# Altium project OpenBLC.PrjPcb
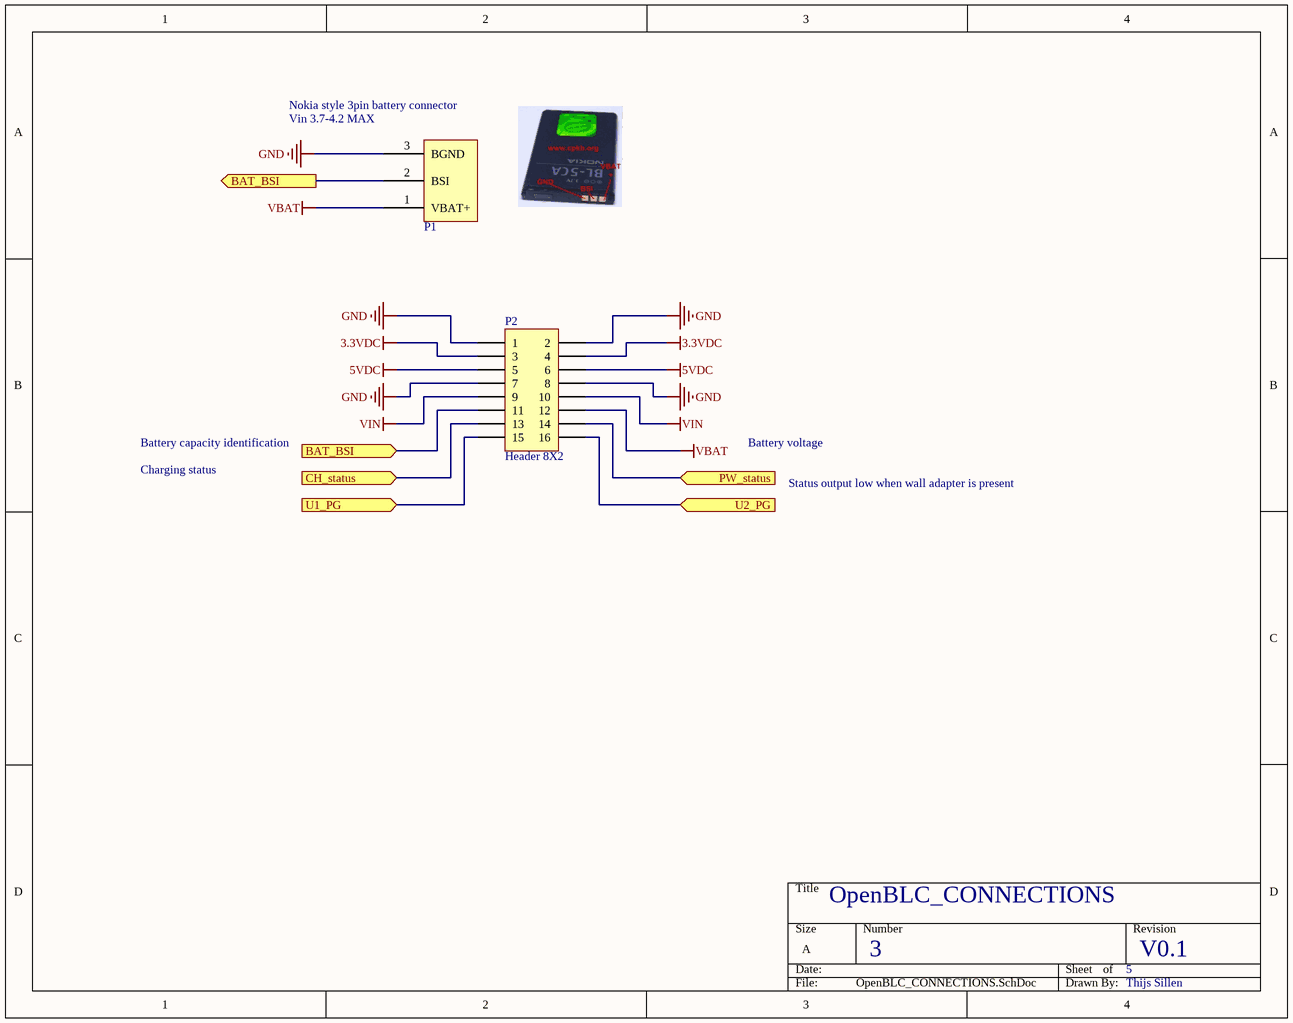
[diagram p0: OpenBLC_CONNECTIONS.SchDoc]
5 sheets, 40 parts. Net scope: flat (ports and power ports of the same name join across sheets).
Board file: OpenBLC.PcbDoc
Sheets:
  OpenBLC_CONNECTIONS.SchDoc
  OpenBLC_MCP73831.SchDoc
  OpenBLC_LTC4412.SchDoc
  OpenBLC_TPS61230.SchDoc
  OpenBLC_TPS62152.SchDoc

## Sheet OpenBLC_CONNECTIONS.SchDoc
size A

### Parts
P1  Nokia 3pin pogo connector  [Nokia_3P_batt_conn]  (value not drawn)
P2  Header 8X2  [HDR2X8]

### Ports
BAT_BSI (in), BAT_BSI (out), CH_status (in), PW_status (in), U1_PG (in), U2_PG (in)

### Nets
3.3VDC: P2.3 P2.4
5VDC: P2.5 P2.6
GND: P1.3(BGND) P2.1 P2.2 P2.7 P2.8
VBAT: P1.1(VBAT+) P2.12
VIN: P2.9 P2.10
NetP1_2: P1.2(BSI) P2.11 ; port BAT_BSI
NetP2_13: P2.13 ; port CH_status
NetP2_14: P2.14 ; port PW_status
NetP2_15: P2.15 ; port U1_PG
NetP2_16: P2.16 ; port U2_PG

### Notes on the sheet
- (near P1) Nokia style 3pin battery connector
- (near P1) Vin 3.7-4.2 MAX
- Battery capacity identification
- Charging status
- Battery voltage
- Status output low when wall adapter is present
- OpenBLC_CONNECTIONS
- 3
- 5
- V0.1
- Thijs Sillen

### Library data of the parts
P1 = Nokia_3PIN_BATT_CONTACT
P2 = Header 8X2: Header, 8-Pin, Dual row; LatestRevisionDate: 17-Jul-2002; LatestRevisionNote: Re-released for DXP Platform.; Publisher: Altium Limited

## Sheet OpenBLC_MCP73831.SchDoc
size A
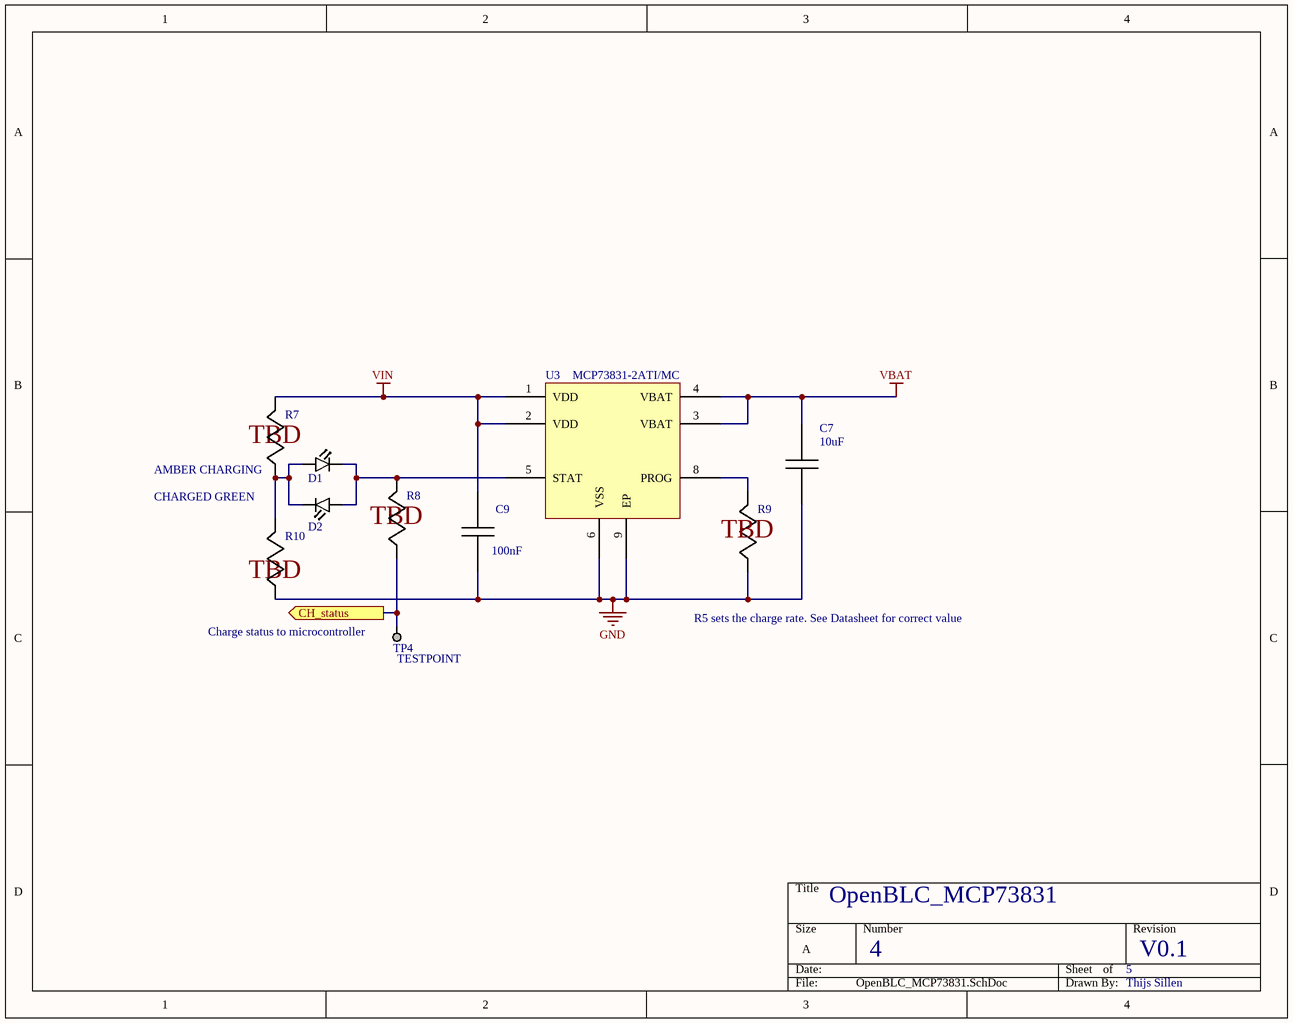
[diagram p1: OpenBLC_MCP73831.SchDoc]

### Parts
C7  Capacitance: 10uF  [0805_CAP]  (hidden comment: GRM21BR61A106KE19L)
C9  =Value: 100nF  [0805_CAP]  (hidden comment: 0805_CAP)
D1  0603LED_YE  [0603 _DIODE_YE]  (value not drawn)
D2  0603LED_GR  [0603 _DIODE_GR]  (value not drawn)
R7  0805_RES  [0805_RES]  (value not drawn)
R8  0805_RES  [0805_RES]  (value not drawn)
R9  0805_RES  [0805_RES]  (value not drawn)
R10  0805_RES  [0805_RES]  (value not drawn)
TP4  TESTPOINT  [Via_TP]
U3  MCP73831-2ATI/MC  [PQFN50P300X200X5_HS-9N]

### Ports
CH_status (out)

### Nets
GND: C7.2 C9.2 R9.2 R10.2 U3.6(VSS) U3.9(EP)
VBAT: C7.1 U3.3(VBAT) U3.4(VBAT)
VIN: C9.1 R7.1 U3.1(VDD) U3.2(VDD)
NetD1_1: D1.1 D2.2 R8.1 U3.5(STAT)
NetD1_2: D1.2 D2.1 R7.2 R10.1
NetP2_13: R8.2 TP4.1 ; port CH_status
NetR9_1: R9.1 U3.8(PROG)

### Notes on the sheet
- (near R7) AMBER CHARGING
- CHARGED GREEN
- (near R7) TBD
- (near R8) TBD
- (near R9) TBD
- (near TP4) Charge status to microcontroller
- (near R10) TBD
- R5 sets the charge rate. See Datasheet for correct value
- OpenBLC_MCP73831
- 4
- 5
- V0.1
- Thijs Sillen

### Library data of the parts
C7 = GRM21BR61A106KE19L: MURATA - GRM21BR61A106KE19L - CAPACITOR, CERA, 10UF, 10%, 10V, 10%, SMD; Product Range: MURATA - GRM Series; Dielectric Characteristic: X5; Voltage Rating: 10; Ceramic Capacitor Case: 0805 ^2012 Metric]; Supplier 1: Farnell; Supplier Part Number 1: 2396552; Manufacturer: MURATA; RoHS: YES; Stock 1: 20106; Pricing 1: 1=0.042, 250=0.039, 500=0.034, 1000=0.031, 5000=0.022 (EUR); Capacitance Tolerance: ± 10%; MSL: -; ComponentLink1URL: http://www.farnell.com/datasheets/608985.pdf; ComponentLink1Description: http://www.farnell.com/datasheets/608985.pdf; Manufacturer Part Number: GRM21BR61A106KE19L
TP4 = TESTPOINT: TESTPOINT SCOPE GRABBER; Manufacturer Part Number: 5010; Manufacturer: Keystone Electronics; Reel: TH; Supplier 1: Digi-Key; Supplier Part Number 1: 5010K-ND
U3 = MCP73831-2ATI/MC: Batterijbeheer Li-Ion/Li-Poly Charg Mgnt 4.2V Vreg out; Manufacturer: Microchip Technology; Uitgangsstroom: 15 mA to 500 mA; Verpakking / doos: DFN; Verpakken: Tube; Montagetype: SMD/SMT; Batterijtype: Li-Ion, Li-Poly; Fabrikant: Microchip; Maximale bedrijfstemperatuur: + 85 C; Minimale bedrijfstemperatuur: - 40 C; Productcategorie: Battery Management; Standaard pakket hoeveelheid: 150; Supplier 1: Mouser; Supplier Part Number 1: 579-MCP73831-2ATI/MC; RoHS: RoHS Compliant; Category: Batterijbeheer; Stock 1: 0; Pricing 1: 1=0.512, 10=0.472, 25=0.392, 100=0.360 (EUR); Uitgangspanning: 4.2 V; Merk: Microchip Technology; Producttype: Charge Management; RoHS - Mouser: Y; Minimum Order Quantity: 1; Reeling: False; ComponentLink1URL: http://www.mouser.com/ds/2/268/21984e-53484.pdf; ComponentLink1Description: http://www.mouser.com/ds/2/268/21984e-53484.pdf; Manufacturer Part Number: MCP73831-2ATI/MC

## Sheet OpenBLC_LTC4412.SchDoc
size A
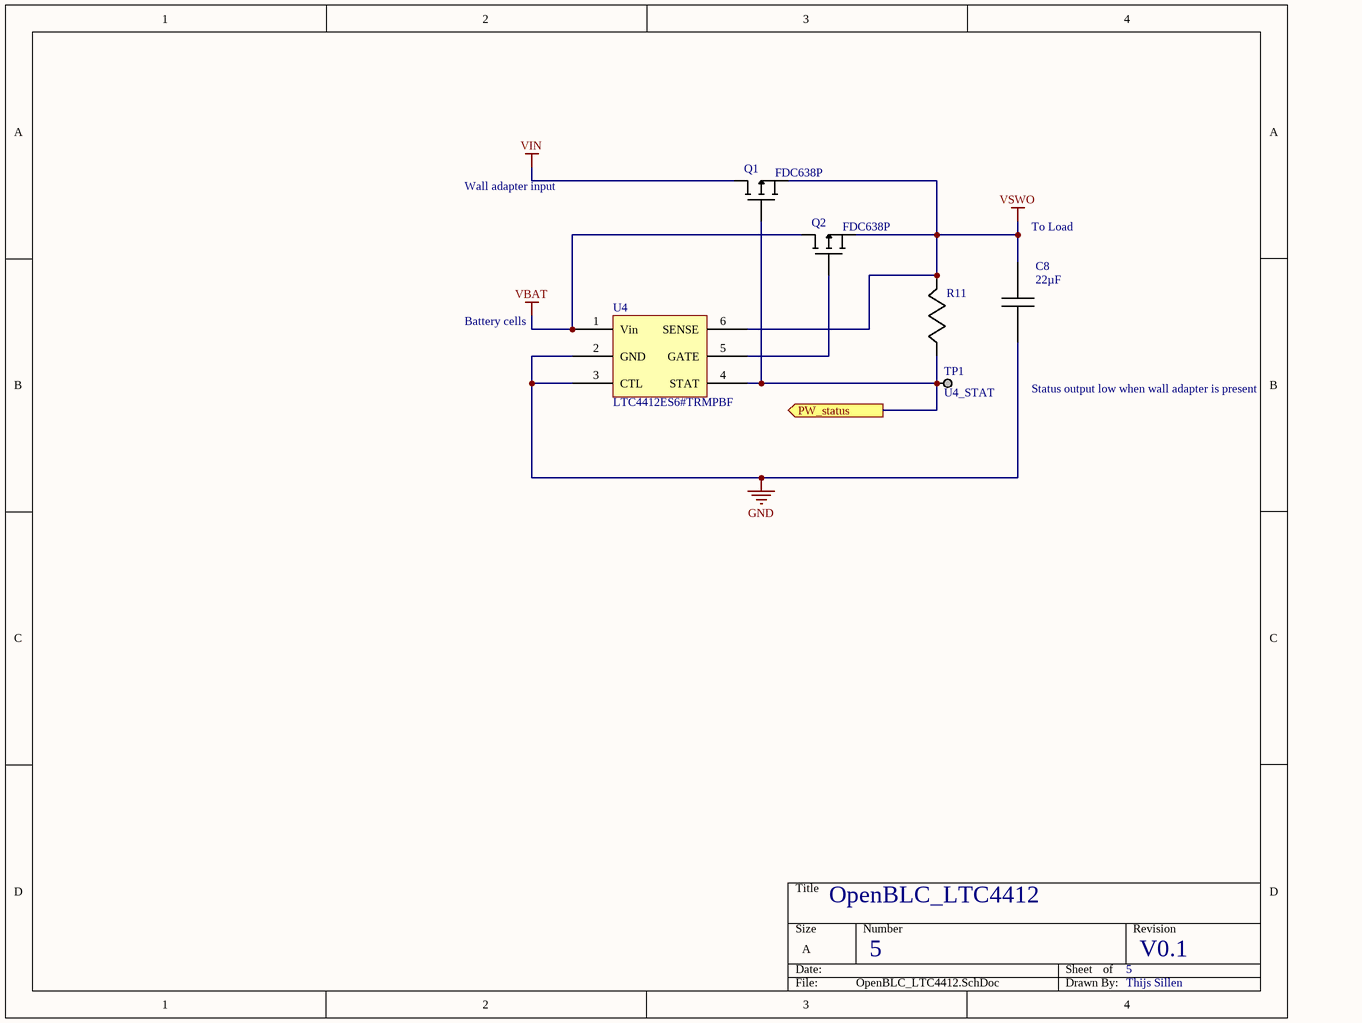
[diagram p2: OpenBLC_LTC4412.SchDoc]

### Parts
C8  Capacitance: 22µF  [0805_CAP]  (hidden comment: C2012X5R0J226M125AC)
Q1  FDC638P  [FDC638P]
Q2  FDC638P  [FDC638P]
R11  0805_RES  [0805_RES]  (value not drawn)
TP1  U4_STAT  [Via_TP]
U4  LTC4412ES6#TRMPBF  [SOT95P280X110-6N]

### Ports
PW_status (out)

### Nets
GND: C8.2 U4.2(GND) U4.3(CTL)
VBAT: Q2.1(D) U4.1(Vin)
VIN: Q1.1(D)
VSWO: C8.1 Q1.3(S) Q2.3(S) R11.1 U4.6(SENSE)
NetP2_14: Q1.2(G) R11.2 TP1.1 U4.4(STAT) ; port PW_status
NetQ2_2: Q2.2(G) U4.5(GATE)

### Notes on the sheet
- Wall adapter input
- (near C8) To Load
- Battery cells
- Status output low when wall adapter is present
- OpenBLC_LTC4412
- 5
- V0.1
- Thijs Sillen

### Library data of the parts
C8 = C2012X5R0J226M125AC: CAP CER 22UF 6.3V 20% X5R 0805; Manufacturer: TDK Corporation; Supplier 1: Digi-Key; Supplier Part Number 1: 445-1422-1-ND; RoHS: RoHS Compliant; Category: Capacitors; Stock 1: 147939; Pricing 1: 1=0.24, 10=0.204, 100=0.1021, 250=0.07656, 500=0.06762, 1000=0.05878 (EUR); Packaging: Cut Tape (CT); Tolerance: ±20%; Voltage - Rated: 6.3V; Temperature Coefficient: X5R; Mounting Type: Surface Mount, MLCC; Operating Temperature: -55°C ~ 85°C; Applications: General Purpose; Ratings: -; Package / Case: 0805 (2012 Metric); Size / Dimension: 0.079" L x 0.049" W (2.00mm x 1.25mm); Height - Seated (Max): -; Thickness (Max): 0.057" (1.45mm); Lead Spacing: -; Features: -; Lead Style: -; ComponentLink1URL: http://product.tdk.com/en/catalog/datasheets/mlcc_commercial_general_en.pdf; ComponentLink1Description: http://product.tdk.com/en/catalog/datasheets/mlcc_commercial_general_en.pdf; Manufacturer Part Number: C2012X5R0J226M125AC
Q1 Q2 = FDC638P: MOSFET SSOT-6 P-CH -20V; Manufacturer: Fairchild Semiconductor; Configuratie: Single Quad Drain; Verpakken: Reel; Voorwaartse transconductantie - min: 15 S; Montagetype: SMD/SMT; Polariteit transistor: P-Channel; Kanaalmodus: Enhancement; Daaltijd: 9 ns; Id - Continue afvoerstroom: 4.5 A; Maximale bedrijfstemperatuur: + 150 C; Minimale bedrijfstemperatuur: - 55 C; Pd - Vermogensverlies: 1.6 W; Rds On - Druppelbronweerstand: 48 mOhms; Standaard pakket hoeveelheid: 3000; Typische uitschakelvertragingstijd: 33 ns; Vgs - Doorslagspanning van ingangsbron: 12 V; Product Status: New Product; Supplier 1: Mouser; Supplier Part Number 1: 512-FDC638P; RoHS: RoHS Compliant; Category: MOSFET; Stock 1: 2304; Pricing 1: 1=0.400, 10=0.272, 100=0.180, 1000=0.139, 3000=0.117, 9000=0.113, 24000=0.107, 45000=0.105 (EUR); Verpakking / doos: SSOT-6; Reeks: FDC638P; Merk: Fairchild Semiconductor; Fabrikant: Fairchild Semiconductor; Stijgtijd: 9 ns; Vds - Doorslagspanning van druppelbron: - 20 V; RoHS - Mouser: Y; Minimum Order Quantity: 1; Reeling: True; ComponentLink1URL: http://www.mouser.com/ds/2/149/FDC638P-103274.pdf; ComponentLink1Description: http://www.mouser.com/ds/2/149/FDC638P-103274.pdf; Manufacturer Part Number: FDC638P
TP1 = TESTPOINT: as TP4 on sheet OpenBLC_MCP73831; Supplier 1: Digi-Key; Supplier Part Number 1: 5010K-ND
U4 = LTC4412ES6#TRMPBF: IC OR CTRLR SRC SELECT TSOT23-6; Manufacturer: Linear Technology; FET Type: P-Channel; Ratio - Input:Output: 2:1; Internal Switch(s): No; Delay Time - ON: 110µs; Delay Time - OFF: 13µs; Current - Supply: 15µA; Voltage - Supply: 2.5 V ~ 28 V; Supplier 1: Digi-Key; Supplier Part Number 1: LTC4412ES6#TRMPBFCT-ND; RoHS: RoHS Compliant; Category: Integrated Circuits (ICs); Stock 1: 19945; Pricing 1: 1=2.79, 25=2.4972, 100=2.2477 (EUR); Packaging: Cut Tape (CT); Type: Source Selector Switch; Current - Output (Max): -; Applications: Handheld/Mobile Devices; Operating Temperature: -40°C ~ 85°C; Mounting Type: Surface Mount; Package / Case: SOT-23-6 Thin, TSOT-23-6; Supplier Device Package: TSOT-23-6; ComponentLink1URL: http://www.linear.com/docs/1527; ComponentLink1Description: http://www.linear.com/docs/1527; Manufacturer Part Number: LTC4412ES6#TRMPBF

## Sheet OpenBLC_TPS61230.SchDoc
size A
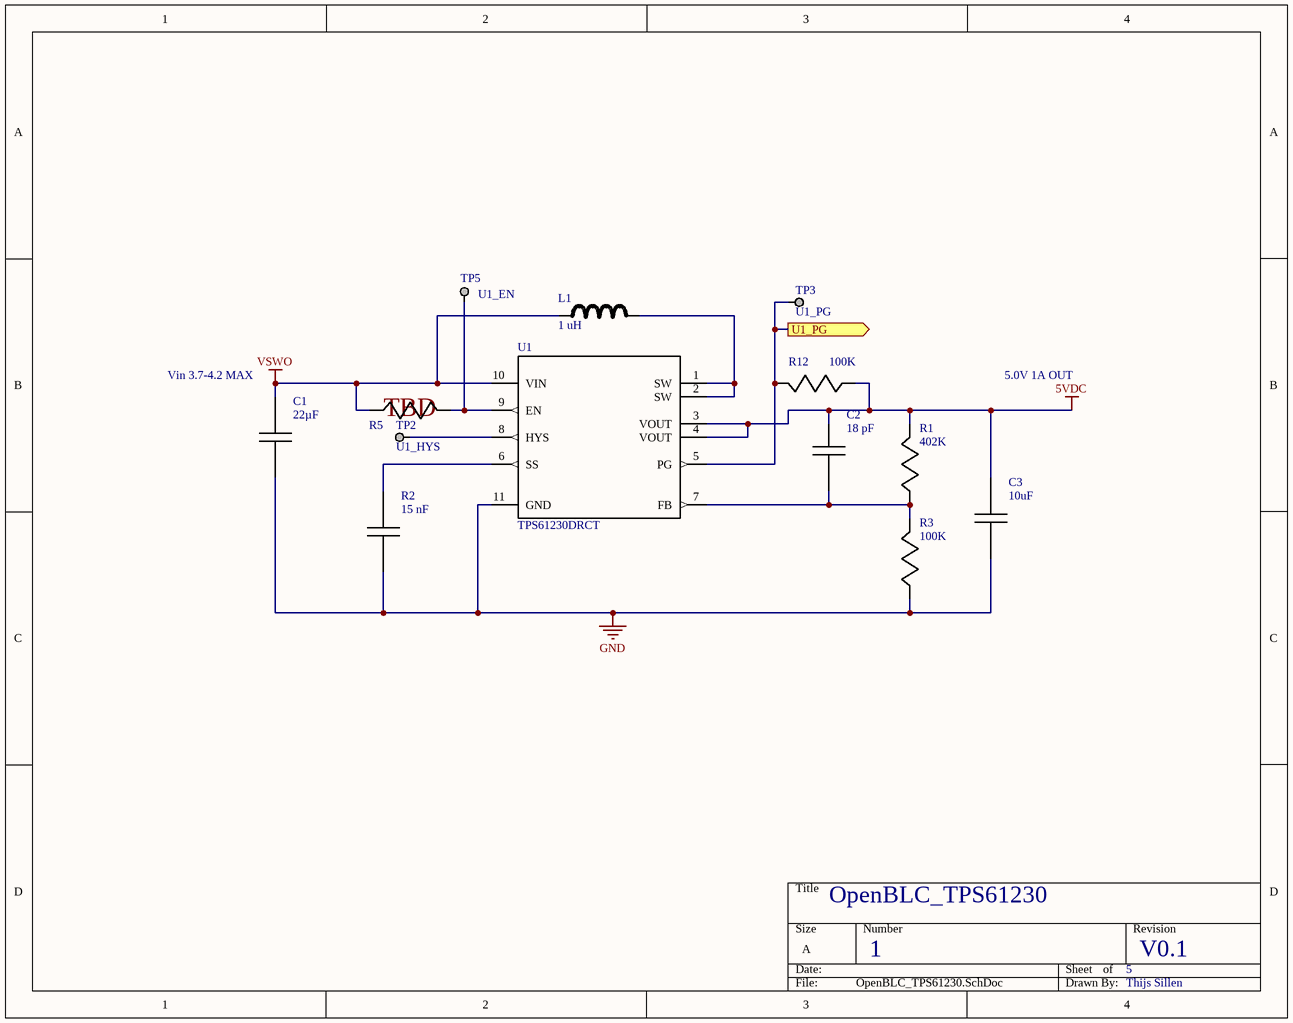
[diagram p3: OpenBLC_TPS61230.SchDoc]

### Parts
C1  Capacitance: 22µF  [0805_CAP]  (hidden comment: C2012X5R0J226M125AC)
C2  Capaciteit: 18 pF  [0603_CAP]  (hidden comment: C0603C180J5GACTU)
C3  Capacitance: 10uF  [0805_CAP]  (hidden comment: GRM21BR61A106KE19L)
L1  Inductantie: 1 uH  [SRU1028]  (hidden comment: SRU1028-1R0Y)
R1  Resistance: 402K  [0402_RES]  (hidden comment: CRCW0402402KFKED)
R2  Capaciteit: 15 nF  [0402_CAP]  (hidden comment: GRM155R71C153KA01D)
R3  Resistance: 100K  [0402_RES]  (hidden comment: CRCW0402100KFKEDHP)
R5  0805_RES  [0805_RES]  (value not drawn)
R12  Resistance: 100K  [0402_RES]  (hidden comment: CRCW0402100KFKEDHP)
TP2  U1_HYS  [Via_TP]
TP3  U1_PG  [Via_TP]
TP5  U1_EN  [Via_TP]
U1  TPS61230DRCT  [TPS61230DRCR]

### Ports
U1_PG (out)

### Nets
5VDC: C2.1 C3.1 R1.1 R12.2 U1.3(VOUT) U1.4(VOUT)
GND: C1.2 C3.2 R2.2 R3.2 U1.11(GND)
VSWO: C1.1 L1.2 R5.2 U1.10(VIN)
NetC2_2: C2.2 R1.2 R3.1 U1.7(FB)
NetL1_1: L1.1 U1.1(SW) U1.2(SW)
NetP2_15: R12.1 TP3.1 U1.5(PG) ; port U1_PG
NetR2_1: R2.1 U1.6(SS)
NetR5_1: R5.1 TP5.1 U1.9(EN)
NetTP2_1: TP2.1 U1.8(HYS)

### Notes on the sheet
- (near C1) Vin 3.7-4.2 MAX
- (near R5) TBD
- 5.0V 1A OUT
- OpenBLC_TPS61230
- 1
- 5
- V0.1
- Thijs Sillen

### Library data of the parts
C1 = C2012X5R0J226M125AC: as C8 on sheet OpenBLC_LTC4412; Supplier 1: Digi-Key; Supplier Part Number 1: 445-1422-1-ND; RoHS: RoHS Compliant; Category: Capacitors; Stock 1: 147939; Pricing 1: 1=0.24, 10=0.204, 100=0.1021, 250=0.07656, 500=0.06762, 1000=0.05878 (EUR); Packaging: Cut Tape (CT); Tolerance: ±20%; Voltage - Rated: 6.3V; Temperature Coefficient: X5R; Mounting Type: Surface Mount, MLCC; Operating Temperature: -55°C ~ 85°C; Applications: General Purpose; Ratings: -; Package / Case: 0805 (2012 Metric); Size / Dimension: 0.079" L x 0.049" W (2.00mm x 1.25mm); Height - Seated (Max): -; Thickness (Max): 0.057" (1.45mm); Lead Spacing: -; Features: -; Lead Style: -; ComponentLink1URL: http://product.tdk.com/en/catalog/datasheets/mlcc_commercial_general_en.pdf; ComponentLink1Description: http://product.tdk.com/en/catalog/datasheets/mlcc_commercial_general_en.pdf; Manufacturer Part Number: C2012X5R0J226M125AC
C2 = C0603C180J5GACTU: Meerlaagse keramische condensatoren MLCC - SMD/SMT 50volts 18pF C0G 5%; Manufacturer: Kemet; Bedrijfstemperatuurbereik: - 55 C to + 125 C; Verpakking / doos: 0603 (1608 metric); Verpakken: Reel; Reeks: C0603C; Type: C0G Dielectric, Commercial; Nominale spanning: 50 V; Code behuizing - in: 0603; Code behuizing - mm: 1608; Hoogte behuizing: 0.8 mm; Lengte behuizing: 1.6 mm; Klasse: 1; Diëlectrisch: C0G (NP0); Verliesfactor DF: 0.5; Afstand tussen de draden: 0.7 mm; Maximale bedrijfstemperatuur: + 125 C; Minimale bedrijfstemperatuur: - 55 C; Productcategorie: 0603 SMD Ceramic Chip Capacitors; Standaard pakket hoeveelheid: 4000; Temperatuur Coëfficiënt / Code: +/- 30 PPM / C; Supplier 1: Mouser; Supplier Part Number 1: 80-C0603C180J5G; RoHS: RoHS Compliant; Category: Meerlaagse keramische condensatoren MLCC - SMD/SMT; Stock 1: 190281; Pricing 1: 1=0.080, 10=0.014, 100=0.010, 1000=0.006, 4000=0.006, 8000=0.005, 48000=0.004, 100000=0.003 (EUR); Product: General Type MLCCs; Klemtype: SMD/SMT; Tolerantie: 5 %; Nominale spanning DC: 50 V; Merk: Kemet; Breedte behuizing: 0.8 mm; Fabrikant: Kemet; RoHS - Mouser: Y; Minimum Order Quantity: 1; Reeling: True; ComponentLink1URL: http://www.kemet.com/kemet/web/homepage/kechome.nsf/vapubfiles/KEM_C1003_C0G_SMD.pdf/$file/KEM_C1003_C0G_SMD.pdf; ComponentLink1Description: http://www.kemet.com/kemet/web/homepage/kechome.nsf/vapubfiles/KEM_C1003_C0G_SMD.pdf/$file/KEM_C1003_C0G_SMD.pdf; Manufacturer Part Number: C0603C180J5GACTU
C3 = GRM21BR61A106KE19L: as C7 on sheet OpenBLC_MCP73831; Supplier 1: Farnell; Supplier Part Number 1: 2396552; Manufacturer: MURATA; RoHS: YES; Stock 1: 20106; Pricing 1: 1=0.042, 250=0.039, 500=0.034, 1000=0.031, 5000=0.022 (EUR); Capacitance Tolerance: ± 10%; MSL: -; ComponentLink1URL: http://www.farnell.com/datasheets/608985.pdf; ComponentLink1Description: http://www.farnell.com/datasheets/608985.pdf; Manufacturer Part Number: GRM21BR61A106KE19L
L1 = SRU1028-1R0Y: Vaste smoorspoelen 1uH 30% SMD 1028; Manufacturer: Bourns; Kernmateriaal: Ferrite DR/RI; Maximale DC stroom: 7 A; Maximale DC weerstand: 4.9 mOhms; Bedrijfstemperatuurbereik: - 40 C to + 125 C; Verpakking / doos: 1028; Verpakken: Reel; Q minimaal: 14; Zelfresonantiefrequentie: 100 MHz; Afscherming: Shielded; Klemtype: SMD/SMT; Type: Shielded SMD Power Inductors; Hoogte behuizing: 2.8 mm; Lengte behuizing: 10 mm; Productcategorie: Inductors; Standaard pakket hoeveelheid: 1000; Testfrequentie: 7.96 MHz; Supplier 1: Mouser; Supplier Part Number 1: 652-SRU1028-1R0Y; RoHS: RoHS Compliant; Category: Vaste smoorspoelen; Stock 1: 0; Pricing 1: 1=0.660, 10=0.619, 50=0.495, 100=0.470, 200=0.429, 500=0.379, 1000=0.325 (EUR); Product: Inductors; Reeks: SRU1028; Tolerantie: 30 %; Merk: Bourns; Breedte behuizing: 10 mm; Fabrikant: Bourns; RoHS - Mouser: Y; Minimum Order Quantity: 1; Reeling: True; ComponentLink1URL: http://www.mouser.com/ds/2/54/SRU1028-54512.pdf; ComponentLink1Description: http://www.mouser.com/ds/2/54/SRU1028-54512.pdf; Manufacturer Part Number: SRU1028-1R0Y
R1 = CRCW0402402KFKED: VISHAY DRALORIC - CRCW0402402KFKED - RESISTOR, 0402, 402K, 1%; Product Range: VISHAY - CRCW Series; Power Rating: 63; Resistor Case Style: 0402 [1005 Metric]; Resistor Element Material: Thick Film; Temperature Coefficient: ± 100; Voltage Rating: 50; SVHC: No SVHC (16-Dec-2013); Resistor Mounting: SMD<!--FANDB--><div class="features-and-benefits-container"></div>; Supplier 1: Farnell; Supplier Part Number 1: 2140992; Manufacturer: VISHAY DRALORIC; RoHS: Y-EX; Stock 1: 14699; Pricing 1: 50=0.005, 250=0.004, 500=0.003, 1000=0.002, 5000=0.0014 (EUR); Resistance Tolerance: ± 1%; Packaging: Cut Tape; MSL: MSL 1 - Unlimited; ComponentLink1URL: http://www.farnell.com/datasheets/1697337.pdf; ComponentLink1Description: http://www.farnell.com/datasheets/1697337.pdf; Manufacturer Part Number: CRCW0402402KFKED
R2 = GRM155R71C153KA01D: Meerlaagse keramische condensatoren MLCC - SMD/SMT 0402 0.015uF 16volts X7R 10%; Manufacturer: Murata Electronics; Bedrijfstemperatuurbereik: - 55 C to + 125 C; Verpakking / doos: 0402 (1005 metric); Verpakken: Reel; Reeks: GRM; Nominale spanning: 16 V; Code behuizing - in: 0402; Code behuizing - mm: 1005; Hoogte behuizing: 0.5 mm; Lengte behuizing: 1 mm; Fabrikant: Murata; Maximale bedrijfstemperatuur: + 125 C; Minimale bedrijfstemperatuur: - 55 C; Productcategorie: Low & Medium Capacitance SMD Ceramic Chip Capacitors; Standaard pakket hoeveelheid: 10000; Temperatuur Coëfficiënt / Code: +/- 15 %; Supplier 1: Mouser; Supplier Part Number 1: 81-GRM155R71C153KA1D; RoHS: RoHS Compliant; Category: Meerlaagse keramische condensatoren MLCC - SMD/SMT; Stock 1: 72519; Pricing 1: 1=0.112, 10=0.014, 100=0.008, 1000=0.006, 10000=0.005, 20000=0.004, 100000=0.003 (EUR); Product: General Type MLCCs; Klemtype: SMD/SMT; Tolerantie: 10 %; Type: General Purpose MLCC; Nominale spanning DC: 16 V; Merk: Murata Electronics; Breedte behuizing: 0.5 mm; Diëlectrisch: X7R; RoHS - Mouser: Y; Minimum Order Quantity: 1; Reeling: True; ComponentLink1URL: http://psearch.murata.com/capacitor/product/GRM155R71C153KA01%23.pdf; ComponentLink1Description: http://psearch.murata.com/capacitor/product/GRM155R71C153KA01%23.pdf; Manufacturer Part Number: GRM155R71C153KA01D
R3 R12 = CRCW0402100KFKEDHP: VISHAY DRALORIC - CRCW0402100KFKEDHP - RESISTOR, POWER, 100K, 0.125W, 1%; Product Range: VISHAY - CRCW Series; Power Rating: 125; Resistor Case Style: 0402 [1005 Metric]; Resistor Element Material: Thick Film; Temperature Coefficient: ± 100; Voltage Rating: 50; SVHC: No SVHC (16-Dec-2013); External Width: 1; Resistor Mounting: SMD<!--FANDB--><div class="features-and-benefits-container"></div>; Supplier 1: Farnell; Supplier Part Number 1: 1738877; Manufacturer: VISHAY DRALORIC; RoHS: Y-EX; Stock 1: 20841; Pricing 1: 25=0.032, 100=0.024, 500=0.016, 1000=0.011, 10000=0.008 (EUR); Resistance Tolerance: ± 1%; Packaging: Cut Tape; MSL: MSL 1 - Unlimited; ComponentLink1URL: http://www.farnell.com/datasheets/1703058.pdf; ComponentLink1Description: http://www.farnell.com/datasheets/1703058.pdf; Manufacturer Part Number: CRCW0402100KFKEDHP
TP2 TP3 TP5 = TESTPOINT: as TP4 on sheet OpenBLC_MCP73831; Supplier 1: Digi-Key; Supplier Part Number 1: 5010K-ND
U1 = TPS61230DRCT: Manufacturer: Texas Instruments; Ingangsspanning: 2.3 V to 5.5 V; Ingangsspanning MAX.: 5.5 V; Aantal uitgangen: 1 Output; Bedrijfstemperatuurbereik: - 40 C to + 85 C; Uitgangsstroom: 2.1 A; Uitgangspanning: 2.5 V to 5.5 V; Verpakking / doos: VSON-10; Verpakken: Reel; Montagetype: SMD/SMT; Uitschakeling: Shutdown; Schakelfrequentie: 2 MHz; Topologie: Boost; Ingangsspanning MIN: 2.3 V; Maximale bedrijfstemperatuur: + 85 C; Minimale bedrijfstemperatuur: - 40 C; Product Status: New Product; Supplier 1: Mouser; Supplier Part Number 1: 595-TPS61230DRCT; RoHS: RoHS Compliant; Category: Spanningsregelaars - Schakelende regelaars; Stock 1: 464; Pricing 1: 1=2.66, 10=2.38, 25=2.14, 50=2.04, 100=1.94, 250=1.75, 500=1.58, 750=1.42, 1000=1.38 (EUR); Reeks: TPS61230; Type: Step-Up Converter; Merk: Texas Instruments; Fabrikant: Texas Instruments; Voedingsspanning - Min: 2.3 V; RoHS - Mouser: Y; Minimum Order Quantity: 1; Reeling: True; ComponentLink1URL: http://www.mouser.com/ds/2/405/slvsaq2b-350046.pdf; ComponentLink1Description: http://www.mouser.com/ds/2/405/slvsaq2b-350046.pdf; Manufacturer Part Number: TPS61230DRCT

## Sheet OpenBLC_TPS62152.SchDoc
size A
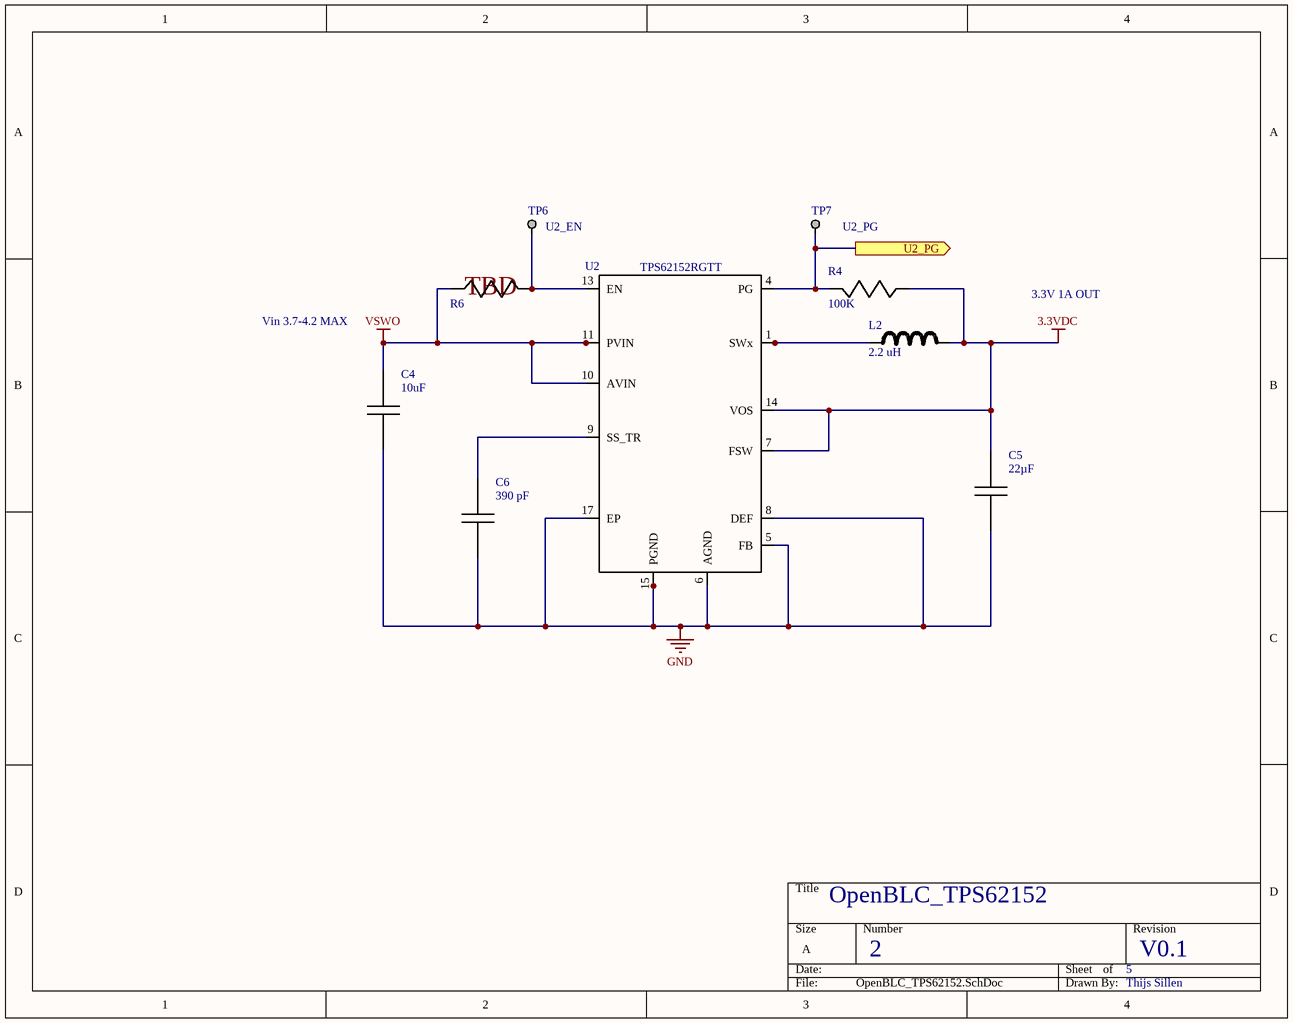
[diagram p4: OpenBLC_TPS62152.SchDoc]

### Parts
C4  Capacitance: 10uF  [0805_CAP]  (hidden comment: GRM21BR61A106KE19L)
C5  Capacitance: 22µF  [0805_CAP]  (hidden comment: C2012X5R0J226M125AC)
C6  Capaciteit: 390 pF  [0603_CAP]  (hidden comment: GRM033R71C391KA01D)
L2  Inductantie: 2.2 uH  [SDR0403]  (hidden comment: SDR0403-2R2ML)
R4  Resistance: 100K  [0402_RES]  (hidden comment: CRCW0402100KFKEDHP)
R6  0805_RES  [0805_RES]  (value not drawn)
TP6  U2_EN  [Via_TP]
TP7  U2_PG  [Via_TP]
U2  TPS62152RGTT  [TPS62152RGTR]

### Ports
U2_PG (out)

### Nets
3.3VDC: C5.1 L2.1 R4.2 U2.7(FSW) U2.14(VOS)
GND: C4.2 C5.2 C6.2 U2.5(FB) U2.6(AGND) U2.8(DEF) U2.15(PGND) U2.16(PGND) U2.17(EP)
VSWO: C4.1 R6.2 U2.10(AVIN) U2.11(PVIN) U2.12(PVIN)
NetC6_1: C6.1 U2.9(SS_TR)
NetL2_2: L2.2 U2.1(SWx) U2.2(SW) U2.3(SW)
NetP2_16: R4.1 TP7.1 U2.4(PG) ; port U2_PG
NetR6_1: R6.1 TP6.1 U2.13(EN)

### Notes on the sheet
- (near R6) TBD
- 3.3V 1A OUT
- Vin 3.7-4.2 MAX
- OpenBLC_TPS62152
- 2
- 5
- V0.1
- Thijs Sillen

### Library data of the parts
C4 = GRM21BR61A106KE19L: as C7 on sheet OpenBLC_MCP73831; Supplier 1: Farnell; Supplier Part Number 1: 2396552; Manufacturer: MURATA; RoHS: YES; Stock 1: 20106; Pricing 1: 1=0.042, 250=0.039, 500=0.034, 1000=0.031, 5000=0.022 (EUR); Capacitance Tolerance: ± 10%; MSL: -; ComponentLink1URL: http://www.farnell.com/datasheets/608985.pdf; ComponentLink1Description: http://www.farnell.com/datasheets/608985.pdf; Manufacturer Part Number: GRM21BR61A106KE19L
C5 = C2012X5R0J226M125AC: as C8 on sheet OpenBLC_LTC4412; Supplier 1: Digi-Key; Supplier Part Number 1: 445-1422-1-ND; RoHS: RoHS Compliant; Category: Capacitors; Stock 1: 147939; Pricing 1: 1=0.24, 10=0.204, 100=0.1021, 250=0.07656, 500=0.06762, 1000=0.05878 (EUR); Packaging: Cut Tape (CT); Tolerance: ±20%; Voltage - Rated: 6.3V; Temperature Coefficient: X5R; Mounting Type: Surface Mount, MLCC; Operating Temperature: -55°C ~ 85°C; Applications: General Purpose; Ratings: -; Package / Case: 0805 (2012 Metric); Size / Dimension: 0.079" L x 0.049" W (2.00mm x 1.25mm); Height - Seated (Max): -; Thickness (Max): 0.057" (1.45mm); Lead Spacing: -; Features: -; Lead Style: -; ComponentLink1URL: http://product.tdk.com/en/catalog/datasheets/mlcc_commercial_general_en.pdf; ComponentLink1Description: http://product.tdk.com/en/catalog/datasheets/mlcc_commercial_general_en.pdf; Manufacturer Part Number: C2012X5R0J226M125AC
C6 = GRM033R71C391KA01D: Meerlaagse keramische condensatoren MLCC - SMD/SMT 390pF 16 volts 10%; Manufacturer: Murata Electronics; Bedrijfstemperatuurbereik: - 55 C to + 125 C; Verpakking / doos: 0201 (0603 metric); Verpakken: Reel; Reeks: GRM; Type: General Purpose MLCC; Nominale spanning: 16 V; Code behuizing - in: 0201; Hoogte behuizing: 0.3 mm; Lengte behuizing: 0.6 mm; Diëlectrisch: X7R; Fabrikant: Murata; Maximale bedrijfstemperatuur: + 125 C; Minimale bedrijfstemperatuur: - 55 C; Standaard pakket hoeveelheid: 15000; Temperatuur Coëfficiënt / Code: +/- 15 %; Code behuizing - mm: 0603; Supplier 1: Mouser; Supplier Part Number 1: 81-GRM033R71C391KA1D; RoHS: RoHS Compliant; Category: Meerlaagse keramische condensatoren MLCC - SMD/SMT; Stock 1: 6120; Pricing 1: 1=0.088, 10=0.011, 100=0.006, 1000=0.005, 2500=0.004, 10000=0.003, 15000=0.003 (EUR); Product: General Type MLCCs; Klemtype: SMD/SMT; Tolerantie: 10 %; Nominale spanning DC: 16 V; Merk: Murata Electronics; Breedte behuizing: 0.3 mm; RoHS - Mouser: Y; Minimum Order Quantity: 1; Reeling: True; ComponentLink1URL: http://psearch.murata.com/capacitor/product/GRM033R71C391KA01%23.pdf; ComponentLink1Description: http://psearch.murata.com/capacitor/product/GRM033R71C391KA01%23.pdf; Manufacturer Part Number: GRM033R71C391KA01D
L2 = SDR0403-2R2ML: Vaste smoorspoelen 2.2uH 20% SMD 0403; Manufacturer: Bourns; Maximale DC stroom: 2.6 A; Maximale DC weerstand: 47 mOhms; Verpakken: Reel; Q minimaal: 28; Zelfresonantiefrequentie: 80 MHz; Klemtype: SMD/SMT; Lengte behuizing: 4.5 mm; Breedte behuizing: 3.2 mm; Productcategorie: Inductors; Standaard pakket hoeveelheid: 2000; Supplier 1: Mouser; Supplier Part Number 1: 652-SDR0403-2R2ML; RoHS: RoHS Compliant; Category: Vaste smoorspoelen; Stock 1: 11347; Pricing 1: 1=0.378, 10=0.279, 100=0.257, 250=0.244, 500=0.202, 1000=0.171, 2000=0.169 (EUR); Reeks: SDR0403; Tolerantie: 20 %; Merk: Bourns; Fabrikant: Bourns; RoHS - Mouser: Y; Minimum Order Quantity: 1; Reeling: True; ComponentLink1URL: http://www.bourns.com/data/global/pdfs/sdr0403.pdf; ComponentLink1Description: http://www.bourns.com/data/global/pdfs/sdr0403.pdf; Manufacturer Part Number: SDR0403-2R2ML
R4 = CRCW0402100KFKEDHP: as R3 on sheet OpenBLC_TPS61230; Supplier 1: Farnell; Supplier Part Number 1: 1738877; Manufacturer: VISHAY DRALORIC; RoHS: Y-EX; Stock 1: 20841; Pricing 1: 25=0.032, 100=0.024, 500=0.016, 1000=0.011, 10000=0.008 (EUR); Resistance Tolerance: ± 1%; Packaging: Cut Tape; MSL: MSL 1 - Unlimited; ComponentLink1URL: http://www.farnell.com/datasheets/1703058.pdf; ComponentLink1Description: http://www.farnell.com/datasheets/1703058.pdf; Manufacturer Part Number: CRCW0402100KFKEDHP
TP6 TP7 = TESTPOINT: as TP4 on sheet OpenBLC_MCP73831; Supplier 1: Digi-Key; Supplier Part Number 1: 5010K-ND
U2 = TPS62152RGTT: Manufacturer: Texas Instruments; Output Type: Fixed; Number of Outputs: 1; Voltage - Output: 3.3V; Voltage - Input: 3 V ~ 17 V; Frequency - Switching: 2.5MHz; Current - Output: 1A; Synchronous Rectifier: Yes; Supplier 1: Digi-Key; RoHS: RoHS Compliant; Category: Integrated Circuits (ICs); Stock 1: 1028; Pricing 1: 1=2.99, 10=2.696, 25=2.4148, 100=2.1715 (USD); Packaging: Cut Tape (CT); Type: Step-Down (Buck); Operating Temperature: -40°C ~ 85°C; Mounting Type: Surface Mount; Package / Case: 16-VFQFN Exposed Pad; Supplier Device Package: 16-QFN (3x3); ComponentLink1URL: http://www.ti.com/lit/ds/symlink/tps62151.pdf; ComponentLink1Description: http://www.ti.com/lit/ds/symlink/tps62151.pdf; Supplier Part Number 1: 296-30009-1-ND

## Nets that join several sheets
3.3VDC: OpenBLC_CONNECTIONS (P2.3 P2.4), OpenBLC_TPS62152 (5 pins)
5VDC: OpenBLC_CONNECTIONS (P2.5 P2.6), OpenBLC_TPS61230 (6 pins)
GND: OpenBLC_CONNECTIONS (5 pins), OpenBLC_MCP73831 (6 pins), OpenBLC_LTC4412 (C8.2 U4.2 U4.3), OpenBLC_TPS61230 (5 pins), OpenBLC_TPS62152 (9 pins)
VBAT: OpenBLC_CONNECTIONS (P1.1 P2.12), OpenBLC_MCP73831 (C7.1 U3.3 U3.4), OpenBLC_LTC4412 (Q2.1 U4.1)
VIN: OpenBLC_CONNECTIONS (P2.9 P2.10), OpenBLC_MCP73831 (C9.1 R7.1 U3.1 U3.2), OpenBLC_LTC4412 (Q1.1)
VSWO: OpenBLC_LTC4412 (5 pins), OpenBLC_TPS61230 (C1.1 L1.2 R5.2 U1.10), OpenBLC_TPS62152 (5 pins)
NetP2_13: OpenBLC_CONNECTIONS (P2.13), OpenBLC_MCP73831 (R8.2 TP4.1)
NetP2_14: OpenBLC_CONNECTIONS (P2.14), OpenBLC_LTC4412 (Q1.2 R11.2 TP1.1 U4.4)
NetP2_15: OpenBLC_CONNECTIONS (P2.15), OpenBLC_TPS61230 (R12.1 TP3.1 U1.5)
NetP2_16: OpenBLC_CONNECTIONS (P2.16), OpenBLC_TPS62152 (R4.1 TP7.1 U2.4)